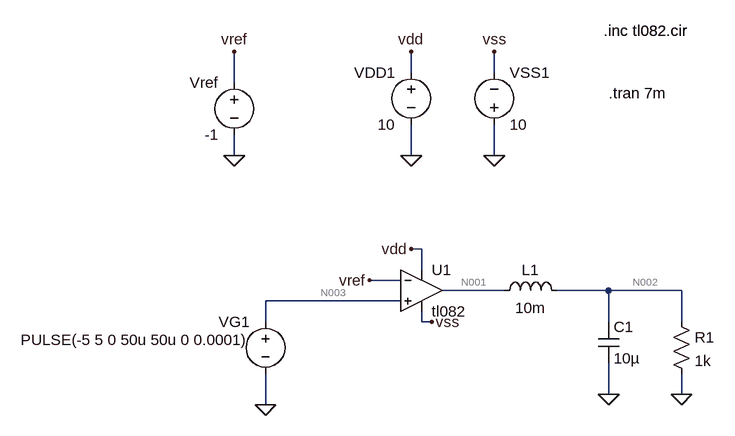
[diagram p0: schematic 9_1_1.asc]
9_1_1.asc, the LTspice schematic file:
Version 4
SHEET 1 880 680
WIRE 64 80 64 48
WIRE 192 80 192 48
WIRE -208 96 -208 48
WIRE -208 208 -208 176
WIRE 64 208 64 160
WIRE 192 208 192 160
WIRE 80 352 64 352
WIRE 80 384 80 352
WIRE 48 400 0 400
WIRE 208 416 112 416
WIRE 368 416 288 416
WIRE 480 416 368 416
WIRE 48 432 -160 432
WIRE -160 464 -160 432
WIRE 80 464 80 448
WIRE 96 464 80 464
WIRE 368 464 368 416
WIRE 480 464 480 416
WIRE 368 576 368 528
WIRE 480 576 480 544
WIRE -160 592 -160 544
FLAG 64 208 0
FLAG 192 208 0
FLAG 64 48 vdd
FLAG 192 48 vss
FLAG 64 352 vdd
FLAG 96 464 vss
FLAG 368 576 0
FLAG 480 576 0
FLAG -160 592 0
FLAG -208 208 0
FLAG -208 48 vref
FLAG 0 400 vref
SYMBOL voltage 64 64 M0
SYMATTR InstName VDD1
SYMATTR Value 10
SYMBOL voltage 192 176 M180
WINDOW 0 24 96 Left 2
WINDOW 3 24 16 Left 2
SYMATTR InstName VSS1
SYMATTR Value 10
SYMBOL voltage -160 448 M0
WINDOW 123 0 0 Left 2
WINDOW 39 0 0 Left 2
WINDOW 3 24 44 Left 2
SYMATTR Value PULSE(-5 5 0 50u 50u 0 0.0001)
SYMATTR InstName VG1
SYMBOL Opamps\\opamp2 80 352 R0
SYMATTR InstName U1
SYMATTR Value tl082
SYMBOL ind 192 432 R270
WINDOW 0 32 56 VTop 2
WINDOW 3 5 56 VBottom 2
SYMATTR InstName L1
SYMATTR Value 10m
SYMBOL cap 352 464 R0
SYMATTR InstName C1
SYMATTR Value 10µ
SYMBOL res 464 448 R0
SYMATTR InstName R1
SYMATTR Value 1k
SYMBOL voltage -208 80 M0
WINDOW 123 0 0 Left 2
WINDOW 39 0 0 Left 2
SYMATTR InstName Vref
SYMATTR Value -1
TEXT 360 16 Left 2 !.inc tl082.cir
TEXT 368 112 Left 2 !.tran 7m
TEXT 360 16 Left 2 !.inc tl082.cir

The netlist it stands for:
* 9_1_1.asc
VDD1 vdd 0 10
VSS1 0 vss 10
VG1 N003 0 PULSE(-5 5 0 50u 50u 0 0.0001)
XU1 N003 vref vdd vss N001 tl082  ; pins In+ In- V+ V- OUT
L1 N001 N002 10m
C1 N002 0 10µ
R1 N002 0 1k
Vref vref 0 -1
.inc tl082.cir
.tran 7m
.inc tl082.cir
.backanno
.end

* Results of the author's LTspice run, read from the files saved beside the schematic
* Operating Point, zero values left out:
*   V(vdd) = 10 V
*   V(vss) = -10 V
*   V(n003) = -5 V
*   V(n001) = -8.477 V
*   V(vref) = -1 V
*   V(n002) = -8.477 V
*   I(L1) = -8.477 mA
*   I(R1) = -8.477 mA
*   I(Vref) = -43.14 pA
*   I(Vg1) = -34.36 pA
*   I(Vss1) = -9.344 mA
*   I(Vdd1) = -9.528 mA
*   Ix(u1:1) = 34.36 pA
*   Ix(u1:2) = 43.14 pA
*   Ix(u1:3) = 9.528 mA
*   Ix(u1:4) = -9.344 mA
*   Ix(u1:5) = 8.477 mA
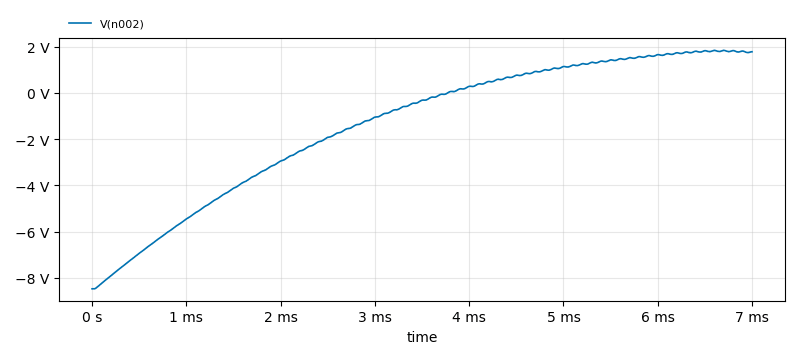
[diagram p1: Transient Analysis of 9_1_1.asc, plotted from the saved traces]
* Transient Analysis, 1 run:
*   V(n002): min -8.477 V, max 1.84 V, average -1.369 V, rms 3.323 V, last 1.78 V